# Altium schematic sheet 2002A.SchDoc
size A4
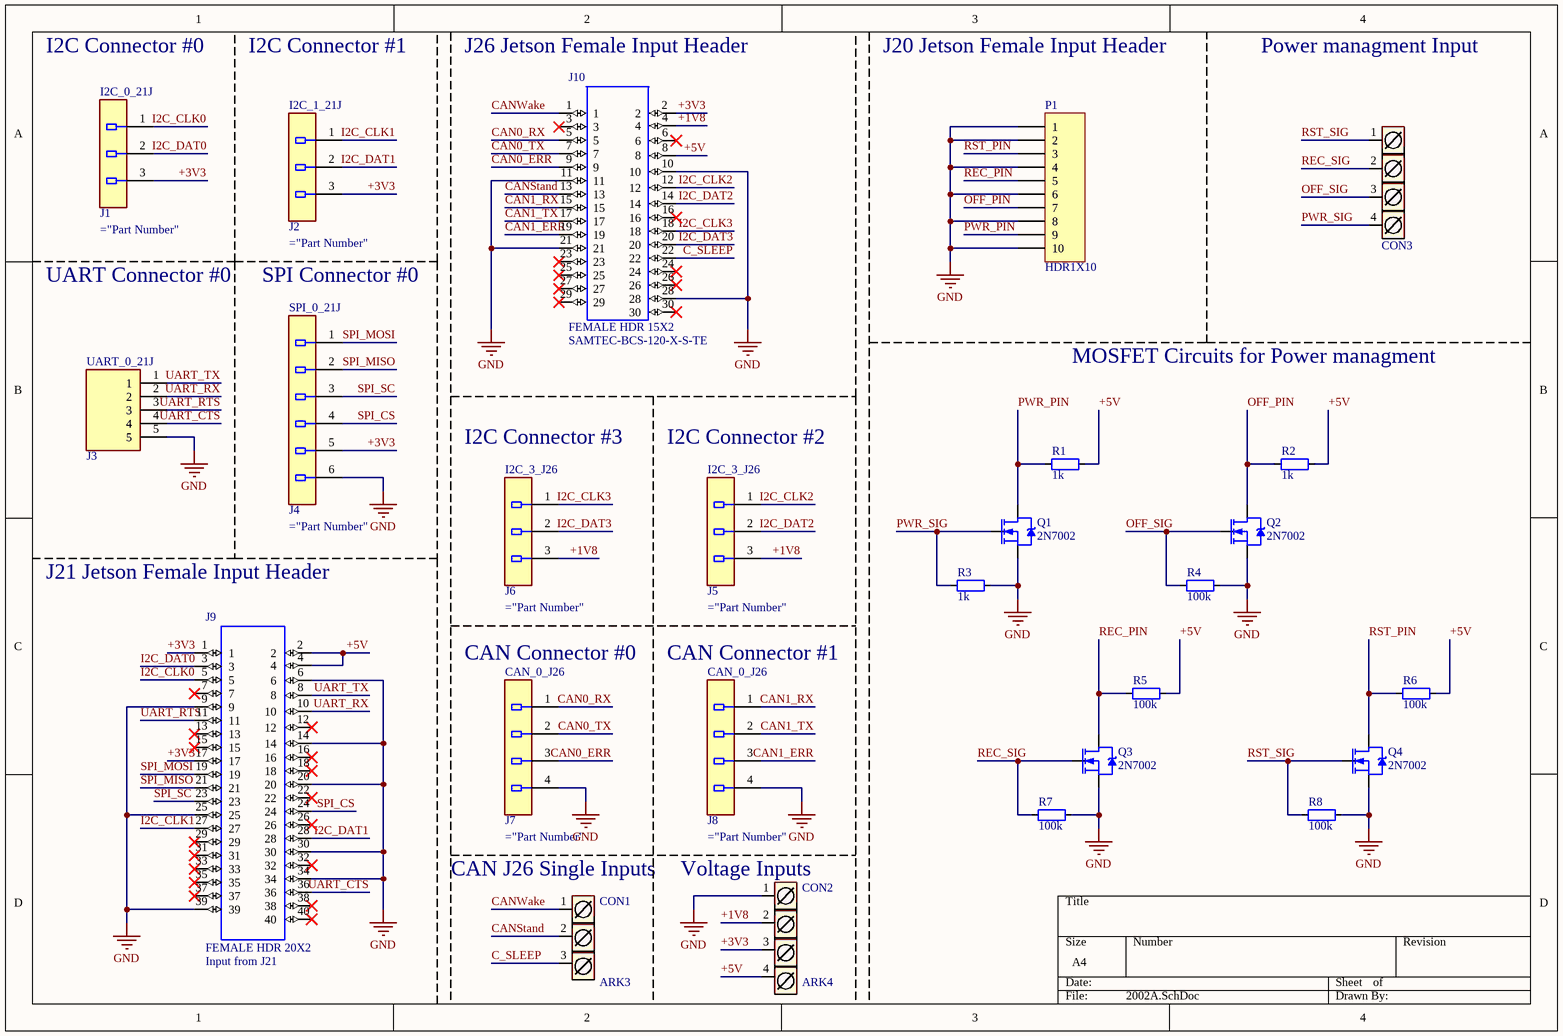
[diagram p0: 2002A.SchDoc]

## Parts
CON1  ARK3  [ARK3]
CON2  ARK4  [ARK4]
CON3  ARK4  [ARK4]  (value not drawn)
J1  I2C_0_21J  [Molex_22-05-7035_MFG]
J2  I2C_1_21J  [Molex_22-05-7035_MFG]
J3  UART_0_21J  [0022057055]
J4  SPI_0_21J  [Molex_22-05-7065_0]
J5  I2C_3_J26  [Molex_22-05-7035_MFG]
J6  I2C_3_J26  [Molex_22-05-7035_MFG]
J7  CAN_0_J26  [Molex_22-05-7045_0]
J8  CAN_0_J26  [Molex_22-05-7045_0]
J9  Input from J21  [SSW-120-XX-X-D]
J10  SAMTEC-BCS-120-X-S-TE  [SSW-115-XX-XXX-D]
P1  HDR1X10  [HDR1X10]
Q1  2N7002  [SOT23]
Q2  2N7002  [SOT23]
Q3  2N7002  [SOT23]
Q4  2N7002  [SOT23]
R1  1k  [0603]
R2  1k  [0603]
R3  1k  [0603]
R4  100k  [0603]
R5  100k  [0603]
R6  100k  [0603]
R7  100k  [0603]
R8  100k  [0603]

## Nets
GND: CON2.1 J3.5 J4.6 J7.4 J8.4 J9.6 J9.9 J9.14 J9.20 J9.25 J9.30 J9.34 J9.39 J10.10 J10.11 J10.21 J10.28 P1.1 P1.2 P1.4 P1.6 P1.8 P1.10 Q1.2(S) Q2.2(S) Q3.2(S) Q4.2(S) R3.2 R4.2 R7.2 R8.2
+1V8: CON2.2 J5.3 J6.3 J10.4
+3V3: CON2.3 J1.3 J2.3 J4.5 J9.1 J9.17 J10.2
+5V: CON2.4 J9.2 J9.4 J10.8 R1.2 R2.2 R5.2 R6.2
C_SLEEP: CON1.3 J10.22
CAN0_ERR: J7.3 J10.9
CAN0_RX: J7.1 J10.5
CAN0_TX: J7.2 J10.7
CAN1_ERR: J8.3 J10.19
CAN1_RX: J8.1 J10.15
CAN1_TX: J8.2 J10.17
CANStand: CON1.2 J10.13
CANWake: CON1.1 J10.1
I2C_CLK0: J1.1 J9.5
I2C_CLK1: J2.1 J9.27
I2C_CLK2: J5.1 J10.12
I2C_CLK3: J6.1 J10.18
I2C_DAT0: J1.2 J9.3
I2C_DAT1: J2.2 J9.28
I2C_DAT2: J5.2 J10.14
I2C_DAT3: J6.2 J10.20
OFF_PIN: P1.7 Q2.3(D) R2.1
OFF_SIG: CON3.3 Q2.1(G) R4.1
PWR_PIN: P1.9 Q1.3(D) R1.1
PWR_SIG: CON3.4 Q1.1(G) R3.1
REC_PIN: P1.5 Q3.3(D) R5.1
REC_SIG: CON3.2 Q3.1(G) R7.1
RST_PIN: P1.3 Q4.3(D) R6.1
RST_SIG: CON3.1 Q4.1(G) R8.1
SPI_CS: J4.4 J9.24
SPI_MISO: J4.2 J9.21
SPI_MOSI: J4.1 J9.19
SPI_SC: J4.3 J9.23
UART_CTS: J3.4 J9.36
UART_RTS: J3.3 J9.11
UART_RX: J3.2 J9.10
UART_TX: J3.1 J9.8

Not connected (* = marked no-connect by the designer): J9 7* 12* 13* 15* 16* 18* 22* 26* 29* 31* 32* 33* 35* 37* 38* 40*; J10 3* 6* 16* 23* 24* 25* 26* 27* 29* 30*

## Notes on the sheet
- I2C Connector #0
- I2C Connector #1
- J26 Jetson Female Input Header
- J20 Jetson Female Input Header
- Power managment Input
- UART Connector #0
- SPI Connector #0
- MOSFET Circuits for Power managment
- I2C Connector #3
- I2C Connector #2
- J21 Jetson Female Input Header
- (near J7) CAN Connector #0
- (near J8) CAN Connector #1
- (near CON1) CAN J26 Single Inputs
- (near CON2) Voltage Inputs
- (in symbol SAMTEC-BCS-120-X-S-TE) FEMALE HDR 15X2; FEMALE HDR 20X2

## Library data of the parts
CON1 = ARK3: Złącze śrubowe 3 piny
CON2 CON3 = ARK4: Złącze śrubowe 4 piny
J1 = 22-05-7035: I2C0
J2 = 22-05-7035: I2C1
J3 = 0022057055: Connector; Manufacturer_Name: Molex; Datasheet Link: https://www.molex.com/pdm_docs/sd/022057055_sd.pdf; Height: 5.1mm; Manufacturer_Part_Number: 0022057055; Arrow Part Number: 0022057055; Mouser Part Number: N/A; Mouser Price/Stock: https://www.mouser.com/Search/Refine.aspx?Keyword=N%2FA
J4 = 22-05-7065
J5 = 22-05-7035: I2C2
J6 = 22-05-7035: I2C3
J7 = 22-05-7045: CAN0
J8 = 22-05-7045: CAN1
J9 J10 = SAMTEC-BCS-120-X-S-TE: 20 Position Receptacle Connector Through Hole; MP: BCS-120-S-S-TE; MF: Samtec; Package: None; Value: *; Availability: Unavailable; SnapEDA_Link: https://www.snapeda.com/parts/BCS-120-S-S-TE/Samtec/view-part/2820457/?ref=snap; Price: None
P1 = HDR1X10: Header, 10-Pin; LatestRevisionDate: 17-Jul-2002; LatestRevisionNote: Re-released for DXP Platform.; Publisher: Altium Limited
R1-R8 = RES: Resistior
  R1-R3: Value: 1k
  R4-R8: Value: 100k